# EAGLE design MBR (EAGLE 9.5.2)
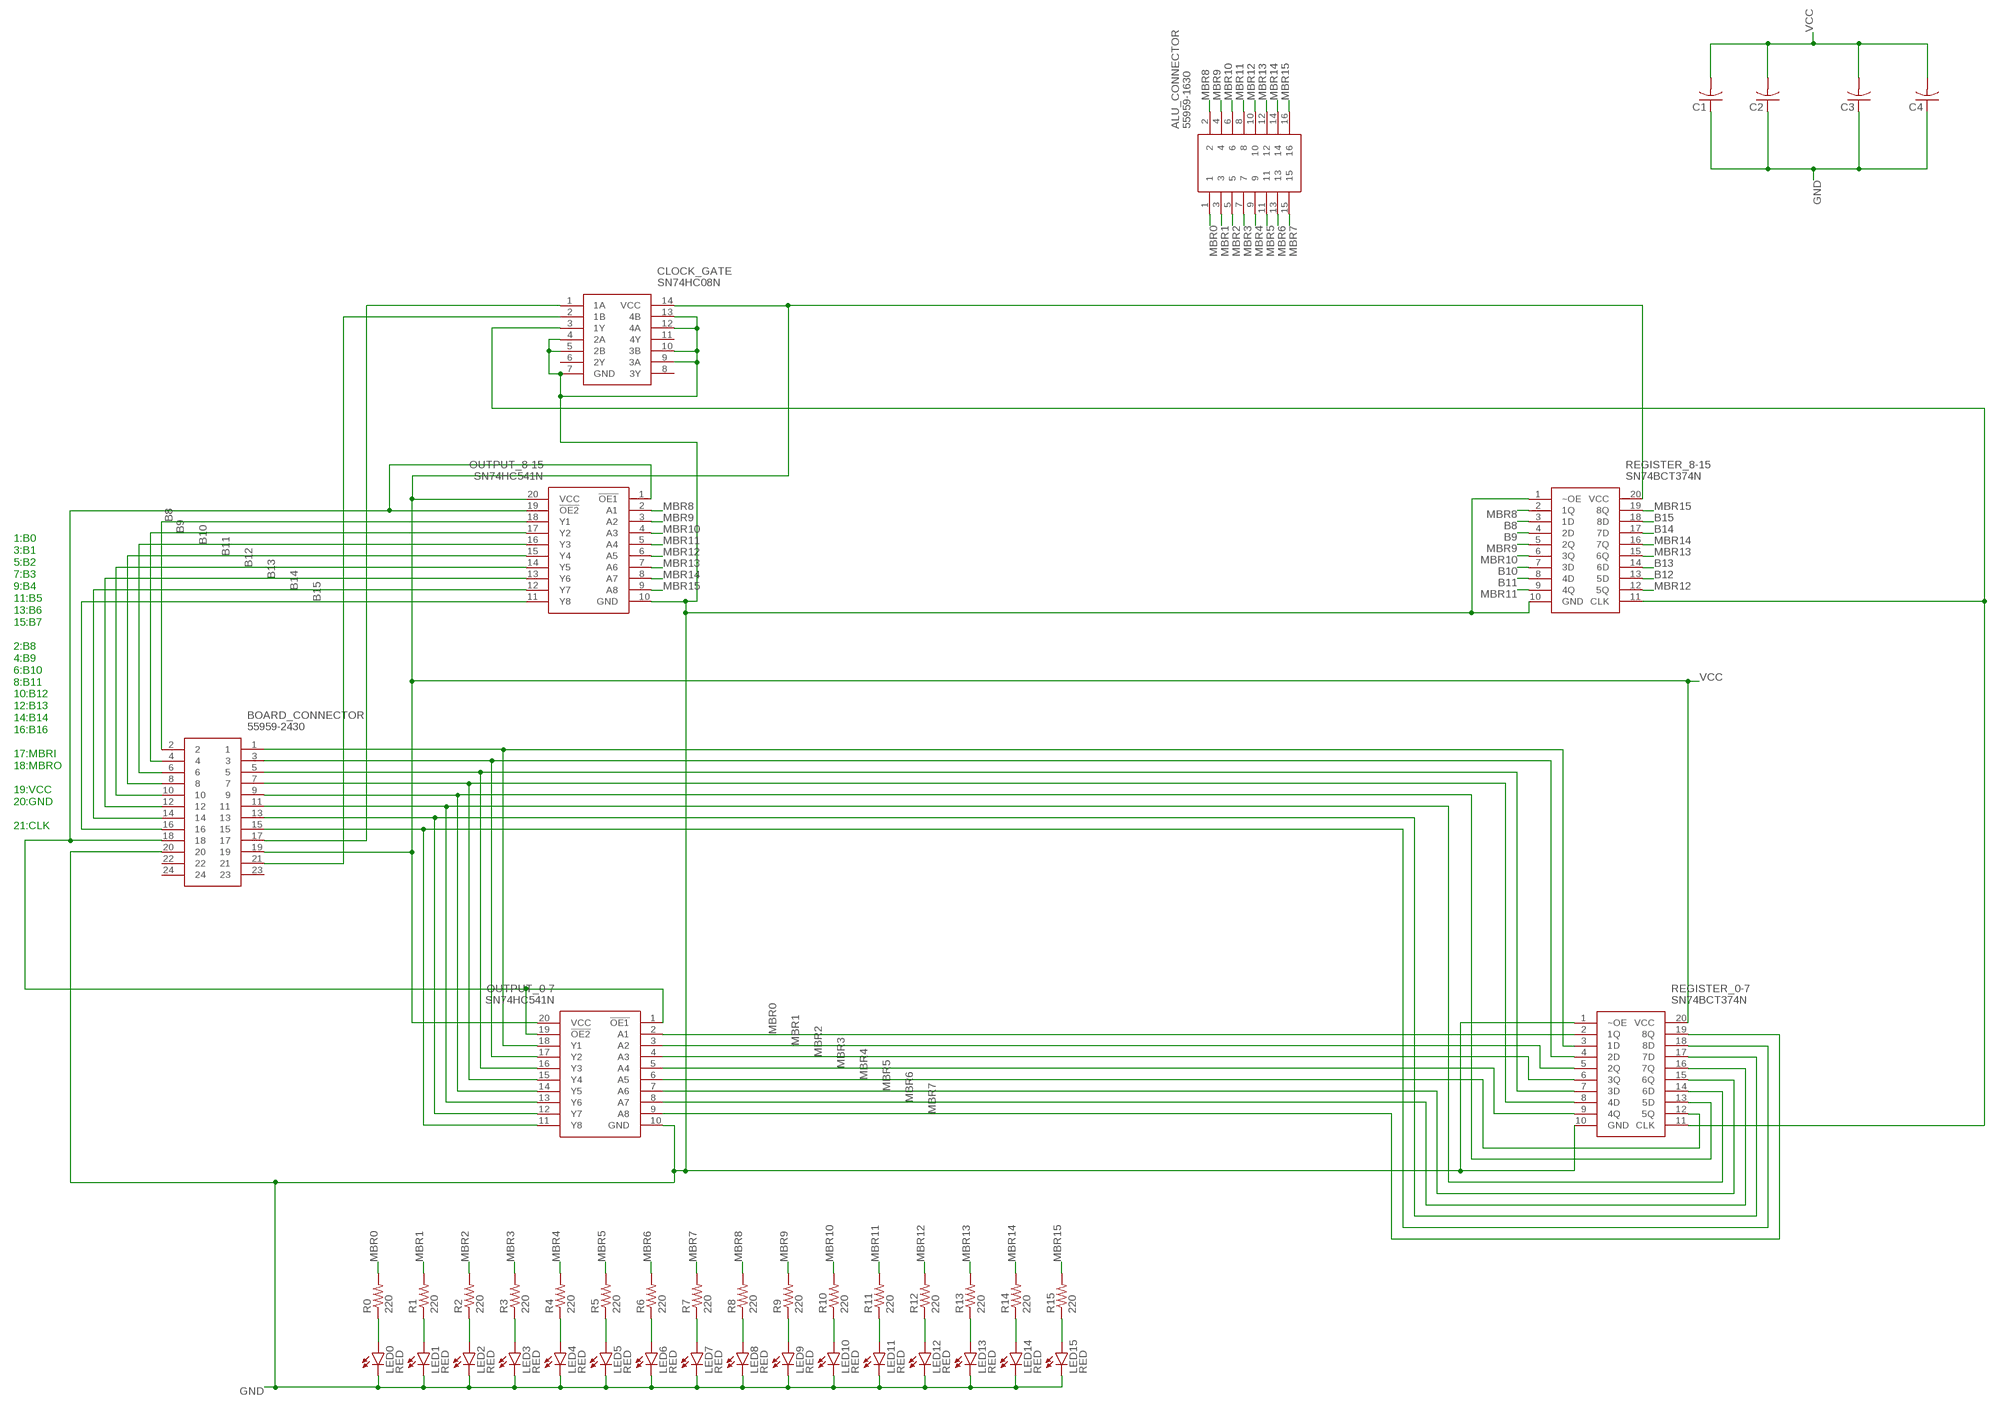
[diagram p0: schematic, sheet 1]

## Parts
ALU_CONNECTOR  55959-1630  [SHDR16W65P250X200_2X8_1940X140]
BOARD_CONNECTOR  55959-2430  [559592430]
C1  C-US025-024X044  [C025-024X044]
C2  C-US025-024X044  [C025-024X044]
C3  C-US025-024X044  [C025-024X044]
C4  C-US025-024X044  [C025-024X044]
CLOCK_GATE  SN74HC08N  [DIP794W53P254L1930H508Q14N]
LED0  RED  LED3MM  [LED3MM]
LED1  RED  LED3MM  [LED3MM]
LED2  RED  LED3MM  [LED3MM]
LED3  RED  LED3MM  [LED3MM]
LED4  RED  LED3MM  [LED3MM]
LED5  RED  LED3MM  [LED3MM]
LED6  RED  LED3MM  [LED3MM]
LED7  RED  LED3MM  [LED3MM]
LED8  RED  LED3MM  [LED3MM]
LED9  RED  LED3MM  [LED3MM]
LED10  RED  LED3MM  [LED3MM]
LED11  RED  LED3MM  [LED3MM]
LED12  RED  LED3MM  [LED3MM]
LED13  RED  LED3MM  [LED3MM]
LED14  RED  LED3MM  [LED3MM]
LED15  RED  LED3MM  [LED3MM]
OUTPUT_0-7  SN74HC541N  [DIP794W53P254L2540H508Q20N]
OUTPUT_8-15  SN74HC541N  [DIP794W53P254L2540H508Q20N]
R0  220  R-US_0204/7  [0204/7]
R1  220  R-US_0204/7  [0204/7]
R2  220  R-US_0204/7  [0204/7]
R3  220  R-US_0204/7  [0204/7]
R4  220  R-US_0204/7  [0204/7]
R5  220  R-US_0204/7  [0204/7]
R6  220  R-US_0204/7  [0204/7]
R7  220  R-US_0204/7  [0204/7]
R8  220  R-US_0204/7  [0204/7]
R9  220  R-US_0204/7  [0204/7]
R10  220  R-US_0204/7  [0204/7]
R11  220  R-US_0204/7  [0204/7]
R12  220  R-US_0204/7  [0204/7]
R13  220  R-US_0204/7  [0204/7]
R14  220  R-US_0204/7  [0204/7]
R15  220  R-US_0204/7  [0204/7]
REGISTER_0-7  SN74BCT374N  [DIP254P762X508-20]
REGISTER_8-15  SN74BCT374N  [DIP254P762X508-20]

## Nets
B8: BOARD_CONNECTOR.2 OUTPUT_8-15.18(Y1) REGISTER_8-15.3(1D)
B9: BOARD_CONNECTOR.4 OUTPUT_8-15.17(Y2) REGISTER_8-15.4(2D)
B10: BOARD_CONNECTOR.6 OUTPUT_8-15.16(Y3) REGISTER_8-15.7(3D)
B11: BOARD_CONNECTOR.8 OUTPUT_8-15.15(Y4) REGISTER_8-15.8(4D)
B12: BOARD_CONNECTOR.10 OUTPUT_8-15.14(Y5) REGISTER_8-15.13(5D)
B13: BOARD_CONNECTOR.12 OUTPUT_8-15.13(Y6) REGISTER_8-15.14(6D)
B14: BOARD_CONNECTOR.14 OUTPUT_8-15.12(Y7) REGISTER_8-15.17(7D)
B15: BOARD_CONNECTOR.16 OUTPUT_8-15.11(Y8) REGISTER_8-15.18(8D)
GND: BOARD_CONNECTOR.20 C1.1 C2.1 C3.1 C4.1 CLOCK_GATE.4(2A) CLOCK_GATE.5(2B) CLOCK_GATE.7(GND) CLOCK_GATE.9(3A) CLOCK_GATE.10(3B) CLOCK_GATE.12(4A) CLOCK_GATE.13(4B) LED0.K(C) LED1.K(C) LED2.K(C) LED3.K(C) LED4.K(C) LED5.K(C) LED6.K(C) LED7.K(C) LED8.K(C) LED9.K(C) LED10.K(C) LED11.K(C) LED12.K(C) LED13.K(C) LED14.K(C) LED15.K(C) OUTPUT_0-7.10(GND) OUTPUT_8-15.10(GND) REGISTER_0-7.1(~OE) REGISTER_0-7.10(GND) REGISTER_8-15.1(~OE) REGISTER_8-15.10(GND)
MBR0: ALU_CONNECTOR.1 OUTPUT_0-7.2(A1) R0.2 REGISTER_0-7.2(1Q)
MBR1: ALU_CONNECTOR.3 OUTPUT_0-7.3(A2) R1.2 REGISTER_0-7.5(2Q)
MBR2: ALU_CONNECTOR.5 OUTPUT_0-7.4(A3) R2.2 REGISTER_0-7.6(3Q)
MBR3: ALU_CONNECTOR.7 OUTPUT_0-7.5(A4) R3.2 REGISTER_0-7.9(4Q)
MBR4: ALU_CONNECTOR.9 OUTPUT_0-7.6(A5) R4.2 REGISTER_0-7.12(5Q)
MBR5: ALU_CONNECTOR.11 OUTPUT_0-7.7(A6) R5.2 REGISTER_0-7.15(6Q)
MBR6: ALU_CONNECTOR.13 OUTPUT_0-7.8(A7) R6.2 REGISTER_0-7.16(7Q)
MBR7: ALU_CONNECTOR.15 OUTPUT_0-7.9(A8) R7.2 REGISTER_0-7.19(8Q)
MBR8: ALU_CONNECTOR.2 OUTPUT_8-15.2(A1) R8.2 REGISTER_8-15.2(1Q)
MBR9: ALU_CONNECTOR.4 OUTPUT_8-15.3(A2) R9.2 REGISTER_8-15.5(2Q)
MBR10: ALU_CONNECTOR.6 OUTPUT_8-15.4(A3) R10.2 REGISTER_8-15.6(3Q)
MBR11: ALU_CONNECTOR.8 OUTPUT_8-15.5(A4) R11.2 REGISTER_8-15.9(4Q)
MBR12: ALU_CONNECTOR.10 OUTPUT_8-15.6(A5) R12.2 REGISTER_8-15.12(5Q)
MBR13: ALU_CONNECTOR.12 OUTPUT_8-15.7(A6) R13.2 REGISTER_8-15.15(6Q)
MBR14: ALU_CONNECTOR.14 OUTPUT_8-15.8(A7) R14.2 REGISTER_8-15.16(7Q)
MBR15: ALU_CONNECTOR.16 OUTPUT_8-15.9(A8) R15.2 REGISTER_8-15.19(8Q)
N$1: BOARD_CONNECTOR.15 OUTPUT_0-7.11(Y8) REGISTER_0-7.18(8D)
N$2: BOARD_CONNECTOR.13 OUTPUT_0-7.12(Y7) REGISTER_0-7.17(7D)
N$3: BOARD_CONNECTOR.11 OUTPUT_0-7.13(Y6) REGISTER_0-7.14(6D)
N$4: BOARD_CONNECTOR.9 OUTPUT_0-7.14(Y5) REGISTER_0-7.13(5D)
N$6: BOARD_CONNECTOR.7 OUTPUT_0-7.15(Y4) REGISTER_0-7.8(4D)
N$7: BOARD_CONNECTOR.5 OUTPUT_0-7.16(Y3) REGISTER_0-7.7(3D)
N$8: BOARD_CONNECTOR.3 OUTPUT_0-7.17(Y2) REGISTER_0-7.4(2D)
N$9: BOARD_CONNECTOR.1 OUTPUT_0-7.18(Y1) REGISTER_0-7.3(1D)
N$10: LED0.A R0.1
N$11: LED1.A R1.1
N$12: LED2.A R2.1
N$13: LED3.A R3.1
N$14: LED4.A R4.1
N$15: LED5.A R5.1
N$16: LED6.A R6.1
N$17: LED7.A R7.1
N$18: BOARD_CONNECTOR.18 OUTPUT_0-7.1(!OE1) OUTPUT_0-7.19(!OE2) OUTPUT_8-15.1(!OE1) OUTPUT_8-15.19(!OE2)
N$20: CLOCK_GATE.3(1Y) REGISTER_0-7.11(CLK) REGISTER_8-15.11(CLK)
N$21: LED8.A R8.1
N$22: BOARD_CONNECTOR.17 CLOCK_GATE.1(1A)
N$23: BOARD_CONNECTOR.21 CLOCK_GATE.2(1B)
N$24: LED9.A R9.1
N$25: LED10.A R10.1
N$26: LED11.A R11.1
N$27: LED12.A R12.1
N$28: LED13.A R13.1
N$29: LED14.A R14.1
N$30: LED15.A R15.1
VCC: BOARD_CONNECTOR.19 C1.2 C2.2 C3.2 C4.2 CLOCK_GATE.14(VCC) OUTPUT_0-7.20(VCC) OUTPUT_8-15.20(VCC) REGISTER_0-7.20(VCC) REGISTER_8-15.20(VCC)
Unconnected: BOARD_CONNECTOR.22 BOARD_CONNECTOR.23 BOARD_CONNECTOR.24 CLOCK_GATE.6(2Y) CLOCK_GATE.8(3Y) CLOCK_GATE.11(4Y)

## Notes on the sheet
- 1:B0
  3:B1
  5:B2
  7:B3
  9:B4
  11:B5
  13:B6
  15:B7
  
  2:B8
  4:B9
  6:B10
  8:B11
  10:B12
  12:B13
  14:B14
  16:B16
  
  17:MBRI
  18:MBRO
  
  19:VCC
  20:GND
  
  21:CLK

## Library data of the parts
ALU_CONNECTOR = SamacSys_Parts:55959-1630: Molex MICROCLASP Series, Series Number 55959, 2mm Pitch 16 Way 2 Row Right Angle PCB Header, Solder Termination, 3A Source: Datasheet <https://componentsearchengine.com/Datasheets/1/55959-1630.pdf>; DESCRIPTION: Molex MICROCLASP Series, Series Number 55959, 2mm Pitch 16 Way 2 Row Right Angle PCB Header, Solder Termination, 3A; HEIGHT: 11.7mm; MANUFACTURER_NAME: Molex; MANUFACTURER_PART_NUMBER: 55959-1630; MOUSER_PART_NUMBER: 538-55959-1630; MOUSER_PRICE-STOCK: https://www.mouser.com/Search/Refine.aspx?Keyword=538-55959-1630
BOARD_CONNECTOR = SamacSys_Parts:55959-2430: Headers & Wire Housings 24 Ckt R.A. Header Source: Datasheet <https://componentsearchengine.com/Datasheets/1/55959-2430.pdf>; DESCRIPTION: Headers & Wire Housings 24 Ckt R.A. Header; HEIGHT: 11.95mm; MANUFACTURER_NAME: Molex; MANUFACTURER_PART_NUMBER: 55959-2430; MOUSER_PART_NUMBER: 538-55959-2430; MOUSER_PRICE-STOCK: https://www.mouser.com/Search/Refine.aspx?Keyword=538-55959-2430
C1-C4 = rcl:C-US: CAPACITOR, American symbol; SPICEPREFIX: C
CLOCK_GATE = SamacSys_Parts:SN74HC08N: QUADRUPLE 2-INPUT POSITIVE-NOR GATES Source: Datasheet <http://componentsearchengine.com/Datasheets/1/SN74HC08N.pdf>; DESCRIPTION: QUADRUPLE 2-INPUT POSITIVE-NOR GATES; HEIGHT: 5.08mm; MANUFACTURER_NAME: Texas Instruments; MANUFACTURER_PART_NUMBER: SN74HC08N; MOUSER_PART_NUMBER: 595-SN74HC08N; MOUSER_PRICE-STOCK: https://www.mouser.com/Search/Refine.aspx?Keyword=595-SN74HC08N
LED0 LED1-LED15 = led:LED: LED OSRAM: - CHIPLED LG R971, LG N971, LY N971, LG Q971, LY Q971, LO R971, LY R971 LH N974, LH R974 LS Q976, LO Q976, LY Q976 LO Q996 - Hyper CHIPLED LW Q18S LB Q993, LB Q99A, LB R99A - SideLED LS A670, LO A670, LY A670, LG A670, LP A670 LB A673, LV A673, LT A673, LW A673 LH A674 LY A675 LS A676, LA A676, LO A676, LY A676, LW A676 LS A679, LY A679, LG A679 - Hyper Micro SIDELED® LS Y876, LA Y876, LO Y876, LY Y876 LT Y87S - SmartLED LW L88C, LW L88S LB L89C, LB L89S, LG L890 LS L89K, LO L89K, LY L89K LS L896, LA L896, LO L896, LY L896 - TOPLED LS T670, LO T670, LY T670, LG T670, LP T670 LSG T670, LSP T670, LSY T670, LOP T670, LYG T670 LG T671, LOG T671, LSG T671 LB T673, LV T673, LT T673, LW T673 LH T674 LS T676, LA T676, LO T676, LY T676, LB T676, LH T676, LSB T676, LW T676 LB T67C, LV T67C, LT T67C, LS T67K, LO T67K, LY T67K, LW E67C LS E67B, LA E67B, LO E67B, LY E67B, LB E67C, LV E67C, LT E67C LW T67C LS T679, LY T679, LG T679 LS T770, LO T770, LY T770, LG T770, LP T770 LB T773, LV T773, LT T773, LW T773 LH T774 LS E675, LA E675, LY E675, LS T675 LS T776, LA T776, LO T776, LY T776, LB T776 LHGB T686 LT T68C, LB T68C - Hyper Mini TOPLED® LB M676 - Mini TOPLED Santana® LG M470 LS M47K, LO M47K, LY M47K Source: http://www.osram.convergy.de LUXEON: - LUMILED® LXK2-PW12-R00, LXK2-PW12-S00, LXK2-PW14-U00, LXK2-PW14-V00 LXK2-PM12-R00, LXK2-PM12-S00, LXK2-PM14-U00 LXK2-PE12-Q00, LXK2-PE12-R00, LXK2-PE12-S00, LXK2-PE14-T00, LXK2-PE14-U00 LXK2-PB12-K00, LXK2-PB12-L00, LXK2-PB12-M00, LXK2-PB14-N00, LXK2-PB14-P00, LXK2-PB14-Q00 LXK2-PR12-L00, LXK2-PR12-M00, LXK2-PR14-Q00, LXK2-PR14-R00 LXK2-PD12-Q00, LXK2-PD12-R00, LXK2-PD12-S00 LXK2-PH12-R00, LXK2-PH12-S00 LXK2-PL12-P00, LXK2-PL12-Q00, LXK2-PL12-R00 Source: www.luxeon.com KINGBRIGHT: KA-3528ASYC Source: www.kingbright.com
OUTPUT_0-7 OUTPUT_8-15 = SamacSys_Parts:SN74HC541N: Octal Buffers And Line Drivers With 3-State Outputs Source: Datasheet <http://componentsearchengine.com/Datasheets/3/SN74HC541N.pdf>; DESCRIPTION: Octal Buffers And Line Drivers With 3-State Outputs; HEIGHT: 5.08mm; MANUFACTURER_NAME: Texas Instruments; MANUFACTURER_PART_NUMBER: SN74HC541N; MOUSER_PART_NUMBER: 595-SN74HC541N; MOUSER_PRICE-STOCK: https://www.mouser.com/Search/Refine.aspx?Keyword=595-SN74HC541N
R0 R1-R15 = rcl:R-US_: RESISTOR, American symbol; SPICEPREFIX: R
REGISTER_0-7 REGISTER_8-15 = SamacSys_Parts:SN74BCT374N: OCTAL EDGE TRIGGERED D TYPE LATCHES Source: Datasheet; DESCRIPTION: OCTAL EDGE TRIGGERED D TYPE LATCHES; HEIGHT: mm; MANUFACTURER_NAME: Texas Instruments; MANUFACTURER_PART_NUMBER: SN74BCT374N; MOUSER_PART_NUMBER: 595-SN74BCT374N; MOUSER_PRICE-STOCK: https://www.mouser.com/Search/Refine.aspx?Keyword=595-SN74BCT374N

## Board
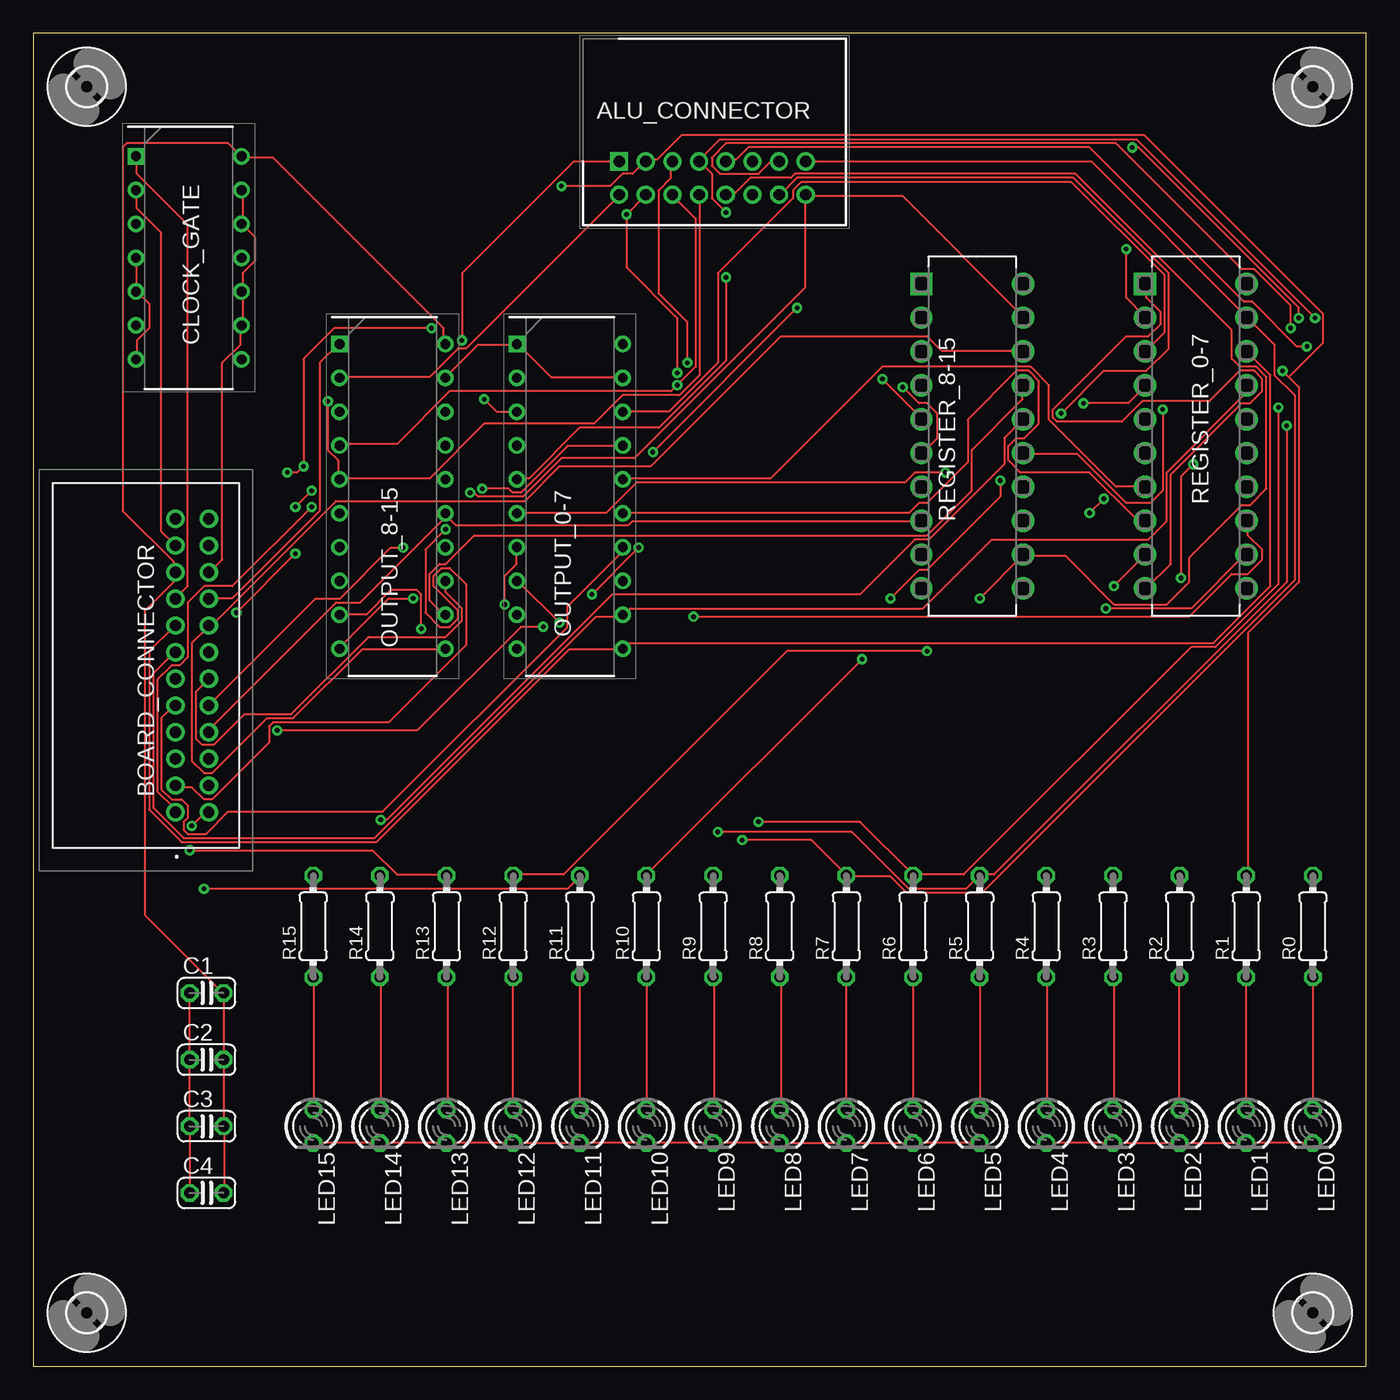
[diagram p1: board, top side]
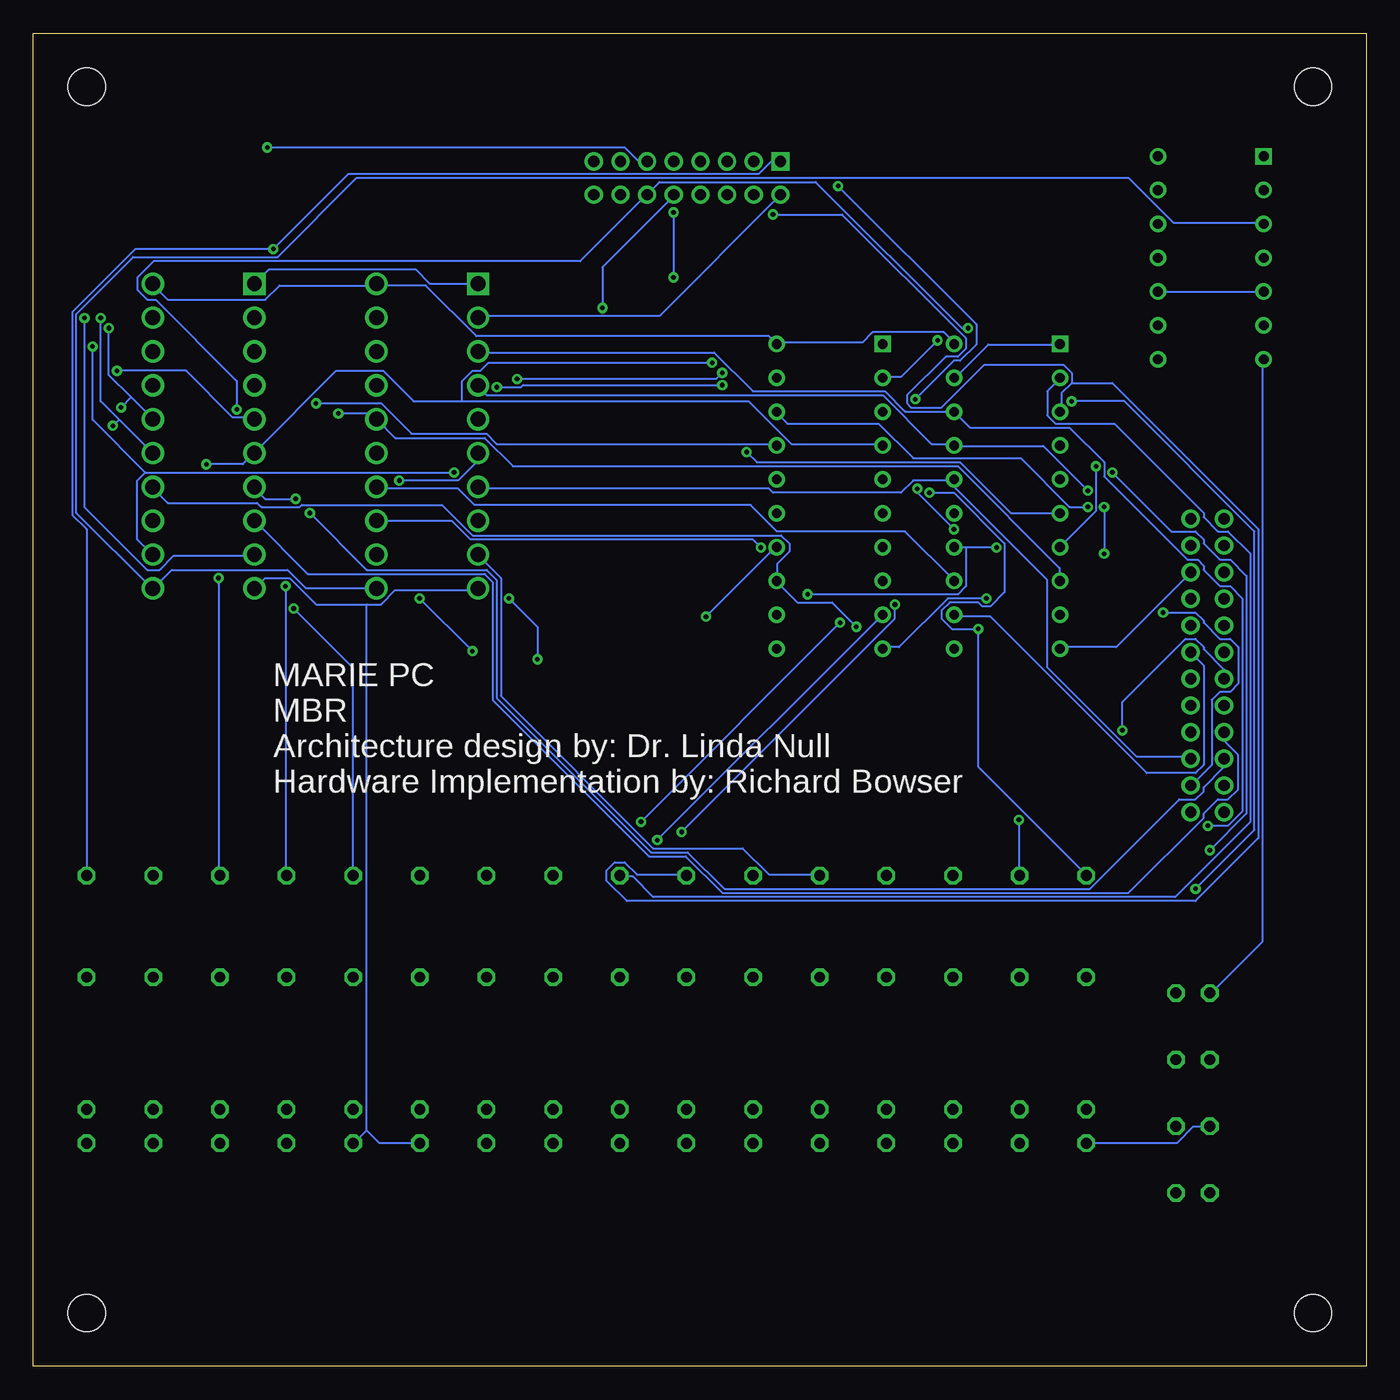
[diagram p2: board, bottom side, seen from below]

Size 100 x 100 mm. Coordinates in mm from the lower left corner, seen from the top.
Outline: 0,0 100,0 100,100 0,100 0,0
Copper layers (1*16): Top 0.035mm / dielectric 1.5mm / Bottom 0.035mm
Design rules "default": minimum track width 6mil, minimum drill 0.35mm, track to track 6mil, track to pad 6mil, pad to pad 6mil, via to via 6mil, smd to smd 6mil, copper to edge 40mil, drill to drill 6mil, minimum pad ring 10mil, minimum via ring 8mil, stop-mask expansion 4mil, vias tented up to drill 0mil, thermal gap 10mil

### Footprints (pad centres in the part's own frame; a part is rotated, then mirrored left to right if it is on the bottom)
SHDR16W65P250X200_2X8_1940X140 = drill 0.85 pad 1.275 square: 1 0,0 | drill 0.85 pad 1.275: 2 0,2.5; 3 -2,0; 4 -2,2.5; 5 -4,0; 6 -4,2.5; 7 -6,0; 8 -6,2.5; 9 -8,0; 10 -8,2.5; 11 -10,0; 12 -10,2.5; 13 -12,0; 14 -12,2.5; 15 -14,0; 16 -14,2.5
559592430 = drill 0.85 pad 1.381: 1 0,0; 2 0,-2.5; 3 2,0; 4 2,-2.5; 5 4,0; 6 4,-2.5; 7 6,0; 8 6,-2.5; 9 8,0; 10 8,-2.5; 11 10,0; 12 10,-2.5; 13 12,0; 14 12,-2.5; 15 14,0; 16 14,-2.5; 17 16,0; 18 16,-2.5; 19 18,0; 20 18,-2.5; 21 20,0; 22 20,-2.5; 23 22,0; 24 22,-2.5
C025-024X044 = drill 0.813 octagon: 1 -1.27,0; 2 1.27,0
DIP794W53P254L1930H508Q14N = drill 0.73 pad 1.13 square: 1 -3.97,7.62 | drill 0.73 pad 1.13: 2 -3.97,5.08; 3 -3.97,2.54; 4 -3.97,0; 5 -3.97,-2.54; 6 -3.97,-5.08; 7 -3.97,-7.62; 8 3.97,-7.62; 9 3.97,-5.08; 10 3.97,-2.54; 11 3.97,0; 12 3.97,2.54; 13 3.97,5.08; 14 3.97,7.62
LED3MM = drill 0.813 octagon: A -1.27,0; K 1.27,0
DIP794W53P254L2540H508Q20N = drill 0.73 pad 1.13 square: 1 -3.97,11.43 | drill 0.73 pad 1.13: 2 -3.97,8.89; 3 -3.97,6.35; 4 -3.97,3.81; 5 -3.97,1.27; 6 -3.97,-1.27; 7 -3.97,-3.81; 8 -3.97,-6.35; 9 -3.97,-8.89; 10 -3.97,-11.43; 11 3.97,-11.43; 12 3.97,-8.89; 13 3.97,-6.35; 14 3.97,-3.81; 15 3.97,-1.27; 16 3.97,1.27; 17 3.97,3.81; 18 3.97,6.35; 19 3.97,8.89; 20 3.97,11.43
0204/7 = drill 0.813 octagon: 1 -3.81,0; 2 3.81,0
DIP254P762X508-20 = drill 1.118 pad 1.676 square: 1 -7.62,22.86 | drill 1.118 pad 1.676: 2 -7.62,20.32; 3 -7.62,17.78; 4 -7.62,15.24; 5 -7.62,12.7; 6 -7.62,10.16; 7 -7.62,7.62; 8 -7.62,5.08; 9 -7.62,2.54; 10 -7.62,0; 11 0,0; 12 0,2.54; 13 0,5.08; 14 0,7.62; 15 0,10.16; 16 0,12.7; 17 0,15.24; 18 0,17.78; 19 0,20.32; 20 0,22.86
2,8 = hole 2.8: 0,0

### Placement (x,y rotation side)
ALU_CONNECTOR  43.95,90.39 180 top
BOARD_CONNECTOR  10.66,41.57 90 top
C1  13,28 0 top
C2  13,23 0 top
C3  13,18 0 top
C4  13,13 0 top
CLOCK_GATE  11.66,83.16 0 top
LED0  96,18 270 top
LED1  91,18 270 top
LED2  86,18 270 top
LED3  81,18 270 top
LED4  76,18 270 top
LED5  71,18 270 top
LED6  66,18 270 top
LED7  61,18 270 top
LED8  56,18 270 top
LED9  51,18 270 top
LED10  46,18 270 top
LED11  41,18 270 top
LED12  36,18 270 top
LED13  31,18 270 top
LED14  26,18 270 top
LED15  21,18 270 top
OUTPUT_0-7  40.25,65.26 0 top
OUTPUT_8-15  26.95,65.26 0 top
R0  96,33 90 top
R1  91,33 90 top
R2  86,33 90 top
R3  81,33 90 top
R4  76,33 90 top
R5  71,33 90 top
R6  66,33 90 top
R7  61,33 90 top
R8  56,33 90 top
R9  51,33 90 top
R10  46,33 90 top
R11  41,33 90 top
R12  36,33 90 top
R13  31,33 90 top
R14  26,33 90 top
R15  21,33 90 top
REGISTER_0-7  91.03,58.35 0 top
REGISTER_8-15  74.25,58.35 0 top
U$1  [2,8]  4,4 0 top
U$2  [2,8]  96,4 0 top
U$3  [2,8]  96,96 0 top
U$4  [2,8]  4,96 0 top

### Tracks (layer width: path | path; a pad name or v marks a point on that pad's centre or on a via)
B8  (via drill 0.35)
  Top 0.152: v11.89,40.54 12.8,41.45 13.11,41.45 BOARD_CONNECTOR.2
  Bottom 0.152: REGISTER_8-15.3 66.6,76.05 48.92,76.05 46.02,73.15 36.12,73.15 34.59,71.63 30.94,71.63 OUTPUT_8-15.18 30.79,71.48 29.72,70.41 22.25,70.41 19.66,67.82 19.66,66.75 13.41,60.5 12.65,60.5 12.19,60.05 12.19,59.74 10.97,58.52 10.21,58.52 9.3,57.61 9.3,41.6 10.36,40.54 v11.89,40.54
B9  (via drill 0.35)
  Top 0.152: v19.66,60.96 v15.24,56.54 | v20.88,65.68 v19.66,64.47
  Bottom 0.152: REGISTER_8-15.4 66.6,73.46 65.99,72.85 36.27,72.85 32.61,69.19 30.94,69.19 OUTPUT_8-15.17 30.79,69.04 24.23,69.04 v20.88,65.68 | v15.24,56.54 12.8,56.54 12.19,55.93 12.19,55.78 10.97,54.56 10.21,54.56 9.6,53.95 9.6,51.21 10.21,50.6 10.97,50.6 11.58,49.99 11.58,45.11 13.11,43.59 BOARD_CONNECTOR.4 | v19.66,64.47 v19.66,60.96
B10
  Bottom 0.152: BOARD_CONNECTOR.6 13.26,45.72 17.22,45.72 23.93,52.43 23.93,58.98 30.79,65.84 30.79,66.45 OUTPUT_8-15.16 30.94,66.45 33.98,66.45 34.9,65.53 44.5,65.53 44.81,65.84 66.6,65.84 REGISTER_8-15.7
B11
  Top 0.152: BOARD_CONNECTOR.8 13.11,47.7 22.71,57.3 24.54,57.3 30.79,63.55 30.79,63.86 OUTPUT_8-15.15 30.94,63.86 31.7,63.09 44.65,63.09 44.96,63.4 66.6,63.4 REGISTER_8-15.8
B12  (via drill 0.35)
  Top 0.152: v27.74,61.42 26.82,61.42 23.01,57.61 21.18,57.61 13.26,49.68 BOARD_CONNECTOR.10 | v41.91,57.91 v45.41,61.42
  Bottom 0.152: v27.74,61.42 30.02,61.42 | 30.02,61.42 30.79,61.42 OUTPUT_8-15.14 | v45.41,61.42 46.02,62.03 67.21,62.03 68.58,63.4 74.22,63.4 REGISTER_8-15.13 | v41.91,57.91 30.63,57.91 30.02,58.52 30.02,61.42
B13
  Top 0.152: OUTPUT_8-15.13 30.94,58.83 30.94,58.06 32.16,56.84 32.16,55.93 30.94,54.71 25.15,54.71 19.36,48.92 15.85,48.92 13.56,46.63 12.65,46.63 12.19,47.09 12.19,50.6 13.11,51.51 BOARD_CONNECTOR.12
  Bottom 0.152: REGISTER_8-15.14 74.22,65.84 68.12,65.84 66.9,64.62 46.18,64.62 44.2,62.64 34.59,62.64 30.94,58.98 OUTPUT_8-15.13
B14
  Top 0.152: REGISTER_8-15.17 74.22,73.46 74.22,72.54 70.41,68.73 70.41,65.68 67.06,62.33 33.07,62.33 30.94,60.2 30.48,60.2 29.72,59.44 29.72,57.45 30.79,56.39 OUTPUT_8-15.12
  Bottom 0.152: OUTPUT_8-15.12 30.79,56.24 28.19,56.24 16.46,44.5 12.8,44.5 12.19,45.11 12.19,52.58 13.11,53.49 BOARD_CONNECTOR.14
B15
  Top 0.152: OUTPUT_8-15.11 30.79,53.8 24.69,53.8 19.51,48.62 17.53,48.62 13.41,44.5 12.8,44.5 11.89,45.41 11.89,54.25 13.11,55.47 BOARD_CONNECTOR.16 13.26,55.47 22.71,64.92 36.88,64.92 39.47,67.51 46.33,67.51 56.08,77.27 67.06,77.27 68.12,76.2 74.22,76.2 REGISTER_8-15.18
GND  (via drill 0.35)
  Top 0.152: CLOCK_GATE.7 7.77,75.59 7.77,76.96 8.69,77.88 8.69,79.7 7.77,80.62 CLOCK_GATE.5 7.77,80.77 7.77,83.06 CLOCK_GATE.4 | CLOCK_GATE.13 15.7,88.24 15.7,85.8 CLOCK_GATE.12 15.7,85.65 16.61,84.73 16.61,82.91 15.7,81.99 15.7,80.77 CLOCK_GATE.10 15.7,80.62 15.7,78.18 CLOCK_GATE.9 15.54,78.03 15.54,76.66 14.17,75.29 14.17,60.5 13.26,59.59 BOARD_CONNECTOR.20 | v28.5,57.61 26.67,57.61 23.01,53.95 OUTPUT_8-15.10 | C4.1 11.73,13.11 11.73,17.98 C3.1 11.73,18.14 11.73,22.86 C2.1 11.73,23.01 11.73,27.89 C1.1 | LED15.K 21.03,16.76 25.91,16.76 LED14.K 26.06,16.76 30.94,16.76 LED13.K 31.09,16.76 35.97,16.76 LED12.K 36.12,16.76 41,16.76 LED11.K 41.15,16.76 45.87,16.76 LED10.K 46.02,16.76 50.9,16.76 LED9.K 51.05,16.76 55.93,16.76 LED8.K 56.08,16.76 60.96,16.76 LED7.K 61.11,16.76 65.99,16.76 LED6.K 66.14,16.76 70.87,16.76 LED5.K | LED0.K 95.86,16.76 91.14,16.76 LED1.K 90.98,16.76 86.11,16.76 LED2.K 85.95,16.76 81.08,16.76 LED3.K 80.92,16.76 76.05,16.76 LED4.K | REGISTER_0-7.1 83.52,81.08 83.52,80.16 84.58,79.1 84.58,78.18 83.67,77.27 81.99,77.27 76.5,71.78 76.5,71.17 76.81,70.87 81.69,70.87 83.21,72.39 88.24,72.39 90.53,74.68 91.59,74.68 92.2,74.07 92.2,73.15 91.29,72.24 90.68,72.24 85.34,66.9 85.34,60.2 83.52,58.37 REGISTER_0-7.10
  Bottom 0.152: CLOCK_GATE.5 7.77,80.62 15.54,80.62 CLOCK_GATE.10 | OUTPUT_8-15.10 22.86,53.95 18.75,53.95 13.26,59.44 BOARD_CONNECTOR.20 | v28.5,57.61 31.39,57.61 35.05,53.95 36.27,53.95 OUTPUT_0-7.10 | C3.1 11.73,17.98 12.95,17.98 14.17,16.76 20.88,16.76 LED15.K | REGISTER_8-15.1 66.75,81.23 70.26,81.23 71.32,82.3 82.3,82.3 83.36,81.23 REGISTER_0-7.1 | 74.98,57.15 78.79,57.15 80.77,59.13 82.6,59.13 83.36,58.37 REGISTER_0-7.10 | 74.98,57.15 73.91,57.15 72.85,58.22 66.75,58.22 REGISTER_8-15.10 | 74.98,17.68 74.98,57.15 | 74.98,17.68 75.89,16.76 LED4.K | 74.98,17.68 74.07,16.76 71.02,16.76 LED5.K | CLOCK_GATE.7 7.77,75.44 7.77,31.85 11.58,28.04 C1.1
MBR0  (via drill 0.35)
  Top 0.152: v32.16,76.96 32.16,81.99 40.54,90.37 43.89,90.37 ALU_CONNECTOR.1 | v81.99,83.82 81.99,80.16 83.36,78.79 REGISTER_0-7.2
  Bottom 0.152: v32.16,76.96 34.9,74.22 36.27,74.22 OUTPUT_0-7.2 | R0.2 96.01,36.88 96.01,62.79 97.08,63.86 97.08,79.1 92.35,83.82 v81.99,83.82 76.35,89.46 45.57,89.46 44.65,90.37 44.04,90.37 ALU_CONNECTOR.1
MBR1  (via drill 0.35)
  Top 0.152: v33.83,72.54 34.75,71.63 36.27,71.63 OUTPUT_0-7.3 | v39.62,88.54 43.28,88.54 44.2,89.46 44.96,89.46 45.87,90.37 ALU_CONNECTOR.3 46.02,90.53 46.79,90.53 48.62,92.35 83.36,92.35 96.77,78.94 96.77,76.81 94.18,74.22 | v93.73,74.68 94.18,74.22 | 94.18,74.22 94.94,73.46 94.94,58.83 91.14,55.02 91.14,36.88 R1.2
  Bottom 0.152: v33.83,72.54 30.94,75.44 30.48,75.44 29.26,76.66 29.26,78.18 v39.62,88.54 | v93.73,74.68 88.54,74.68 85.04,71.17 83.52,71.17 REGISTER_0-7.5
MBR2  (via drill 0.35)
  Top 0.152: v86.11,59.13 86.11,66.75 v87.02,67.67 | v49.07,75.29 49.07,78.33 46.94,80.47 46.94,88.24 47.85,89.15 47.85,90.37 ALU_CONNECTOR.5
  Bottom 0.152: 67.82,72.39 71.48,72.39 73.76,74.68 77.27,74.68 83.36,68.58 REGISTER_0-7.6 83.52,68.43 84.28,67.67 v87.02,67.67 | 67.82,72.39 46.33,72.39 43.13,69.19 36.42,69.19 OUTPUT_0-7.4 | v86.11,59.13 86.11,36.88 R2.2 | v49.07,75.29 65.84,75.29 66.45,74.68 67.06,74.68 67.82,73.91 67.82,72.39
MBR3  (via drill 0.35)
  Top 0.152: v81.08,58.52 83.36,60.81 REGISTER_0-7.9 | v51.97,81.69 51.97,75.44 46.94,70.41 41,70.41 37.19,66.6 36.42,66.6 OUTPUT_0-7.5 | v51.97,86.56 50.9,87.63 50.9,89.46 49.99,90.37 ALU_CONNECTOR.7 49.99,90.53 51.51,92.05 82.75,92.05 v96.16,78.64
  Bottom 0.152: v81.08,58.52 81.08,36.88 R3.2 | v51.97,86.56 v51.97,81.69 | v96.16,78.64 96.16,64.47 91.44,59.74 90.53,59.74 89.46,60.81 83.52,60.81 REGISTER_0-7.9
MBR4  (via drill 0.35)
  Top 0.152: v68.43,67.06 66.14,67.06 65.38,66.29 45.26,66.29 42.98,64.01 36.42,64.01 OUTPUT_0-7.6 | v80.47,56.84 86.87,56.84 90.98,60.96 REGISTER_0-7.12 | v95.56,76.5 94.79,76.5 91.44,79.86 90.83,79.86 79.25,91.44 53.65,91.44 52.73,90.53 51.97,90.53 ALU_CONNECTOR.9
  Bottom 0.152: 91.59,67.06 v68.43,67.06 | 91.59,67.06 92.2,66.45 92.2,62.03 91.14,60.96 REGISTER_0-7.12 | v80.47,56.84 76.05,52.43 76.05,36.88 R4.2 | v95.56,76.5 95.56,71.02 91.59,67.06
MBR5  (via drill 0.35)
  Top 0.152: v35.36,57.15 35.36,59.28 36.27,60.2 36.27,61.42 OUTPUT_0-7.7 | v51.36,40.08 61.42,40.08 65.68,35.81 69.95,35.81 70.87,36.73 R5.2 71.02,36.88 72.08,36.88 94.03,58.83 v94.03,70.56 | v82.45,91.44 82.91,91.44 94.94,79.4 v94.94,78.64
  Bottom 0.152: v35.36,57.15 35.36,56.08 v51.36,40.08 | v82.45,91.44 55.63,91.44 54.71,90.53 54.1,90.53 ALU_CONNECTOR.11 | v94.94,78.64 94.94,72.39 93.57,71.02 | 93.57,71.02 91.14,68.58 REGISTER_0-7.15 | 93.57,71.02 v94.03,70.56
MBR6  (via drill 0.35)
  Top 0.152: v39.47,55.78 36.42,58.83 OUTPUT_0-7.8 | v54.41,40.84 62.03,40.84 65.99,36.88 R6.2 66.14,36.88 69.8,36.88 86.87,53.95 88.7,53.95 93.42,58.67 v93.42,71.93 | v94.34,77.88 94.34,79.55 91.59,82.3 90.68,82.3 81.23,91.75 51.97,91.75 50.9,90.68 50.9,90.07 51.51,89.46 54.41,89.46 55.32,90.37 55.93,90.37 ALU_CONNECTOR.13
  Bottom 0.152: v54.41,40.84 v39.47,55.78 | v94.34,77.88 94.34,74.37 92.66,72.69 | 92.66,72.69 91.14,71.17 REGISTER_0-7.16 | 92.66,72.69 v93.42,71.93
MBR7  (via drill 0.35)
  Top 0.152: v53.19,39.47 58.37,39.47 60.96,36.88 R7.2 61.11,36.73 64.31,36.73 65.53,35.51 71.17,35.51 94.64,58.98 94.64,72.85 93.12,74.37 93.12,76.66 91.14,78.64 REGISTER_0-7.19 90.98,78.79 79.4,90.37 58.06,90.37 ALU_CONNECTOR.15
  Bottom 0.152: v53.19,39.47 36.42,56.24 OUTPUT_0-7.9
MBR8
  Top 0.152: OUTPUT_8-15.2 23.01,74.22 29.72,74.22 31.85,76.35 32.46,76.35 43.89,87.78 ALU_CONNECTOR.2
  Bottom 0.152: R8.2 55.93,36.73 55.02,36.73 53.49,35.2 14.33,35.2 8.69,40.84 8.69,60.96 10.36,62.64 11.12,62.64 12.19,63.7 12.19,64.01 18.9,70.71 23.32,70.71 23.93,71.32 23.93,73.15 23.01,74.07 OUTPUT_8-15.2 | REGISTER_8-15.2 66.6,78.79 53.03,78.79 44.04,87.78 ALU_CONNECTOR.2
MBR9  (via drill 0.35)
  Top 0.152: ALU_CONNECTOR.4 45.87,87.78 v44.5,86.41 44.5,82.45 48.31,78.64 v48.31,74.52 | v63.7,74.07 66.6,71.17 REGISTER_8-15.5
  Bottom 0.152: 22.1,73.76 22.86,73 22.86,71.63 OUTPUT_8-15.3 | 22.1,73.76 22.1,74.52 22.71,75.13 28.65,75.13 31.85,71.93 34.14,71.93 34.44,72.24 34.44,72.85 31.55,75.74 30.63,75.74 30.02,76.35 30.02,77.11 39.32,86.41 v44.5,86.41 | 22.1,73.76 19.05,73.76 8.08,62.79 8.08,39.62 12.8,34.9 55.47,34.9 57,36.42 57,37.19 56.39,37.8 55.63,37.8 54.71,36.88 51.05,36.88 R9.2 | v63.7,74.07 48.77,74.07 v48.31,74.52
MBR10  (via drill 0.35)
  Top 0.152: OUTPUT_8-15.4 23.01,69.19 27.28,69.19 31.24,73.15 47.85,73.15 v48.31,73.61 49.68,74.98 49.68,86.11 48.01,87.78 ALU_CONNECTOR.6 | v62.18,53.03 46.02,36.88 R10.2 | v64.31,57.61 66.45,59.74 67.06,59.74 72.54,65.23 v72.54,66.45 | v65.23,73.46 66.45,72.24 67.06,72.24 67.82,71.48 67.82,69.65 66.75,68.58 REGISTER_8-15.6
  Bottom 0.152: v62.18,53.03 62.18,55.47 v64.31,57.61 | v72.54,66.45 68.12,66.45 66.75,67.82 66.75,68.43 REGISTER_8-15.6 | v48.31,73.61 63.25,73.61 63.4,73.46 v65.23,73.46
MBR11  (via drill 0.35)
  Top 0.152: ALU_CONNECTOR.8 49.99,87.78 49.99,74.37 48.46,72.85 44.2,72.85 42.06,70.71 33.83,70.71 29.72,66.6 23.01,66.6 OUTPUT_8-15.5 22.86,66.6 22.86,67.97 22.1,68.73 v22.1,72.39 | v12.8,35.81 40.08,35.81 41,36.73 R11.2
  Bottom 0.152: R11.2 41.15,36.88 44.81,36.88 46.79,38.86 53.49,38.86 64.92,50.29 64.92,59.13 66.6,60.81 REGISTER_8-15.9 | v22.1,72.39 18.14,72.39 8.38,62.64 8.38,40.23 v12.8,35.81
MBR12  (via drill 0.35)
  Top 0.152: v57.3,79.4 v46.48,68.58 | v67.06,53.65 56.54,53.65 39.78,36.88 36.12,36.88 R12.2 | v71.02,57.61 74.22,60.81 REGISTER_8-15.12 74.37,60.81 77.42,60.81 81.08,57.15 85.04,57.15 86.72,58.83 86.72,60.66 90.68,64.62 91.29,64.62 92.51,65.84 92.51,74.22 91.75,74.98 90.53,74.98 89.92,75.59 89.92,77.72 78.18,89.46 57.15,89.46 56.84,89.15 53.8,89.15 52.58,87.94 51.97,87.94 ALU_CONNECTOR.10
  Bottom 0.152: v46.48,68.58 45.72,67.82 30.48,67.82 26.67,64.01 23.01,64.01 OUTPUT_8-15.6 | v57.3,79.4 57.3,82.45 51.97,87.78 ALU_CONNECTOR.10 | v71.02,57.61 v67.06,53.65
MBR13  (via drill 0.35)
  Top 0.152: v29.87,77.88 22.55,77.88 20.27,75.59 v20.27,67.51 19.81,67.06 v19.05,67.06 | v11.73,38.71 25.45,38.71 27.28,36.88 30.94,36.88 R13.2 | v84.73,71.78 84.73,65.68 83.82,64.77 81.99,64.77 78.33,68.43 74.37,68.43 REGISTER_8-15.15
  Bottom 0.152: v20.27,67.51 20.27,64.16 22.86,61.57 OUTPUT_8-15.7 | v29.87,77.88 30.33,77.88 41.3,88.85 53.03,88.85 53.95,87.94 ALU_CONNECTOR.12 54.1,87.78 58.98,82.91 90.98,82.91 92.2,81.69 92.2,80.77 91.44,80.01 90.83,80.01 84.73,73.91 v84.73,71.78 | v11.73,38.71 8.99,41.45 8.99,59.28 10.21,60.5 10.97,60.5 12.19,61.72 12.19,62.03 12.8,62.64 14.63,62.64 v19.05,67.06
MBR14  (via drill 0.35)
  Top 0.152: v26.06,41 26.52,41 43.43,57.91 62.03,57.91 66.14,62.03 67.21,62.03 72.85,67.67 72.85,69.65 74.22,71.02 REGISTER_8-15.16 | v77.11,71.48 80.31,74.68 83.52,74.68 85.19,76.35 85.19,81.99 78.03,89.15 57.3,89.15 56.08,87.94 ALU_CONNECTOR.14
  Bottom 0.152: OUTPUT_8-15.8 23.01,58.98 23.01,59.89 30.63,67.51 64.01,67.51 66.14,69.65 72.85,69.65 74.22,71.02 REGISTER_8-15.16 74.37,71.17 74.68,71.48 v77.11,71.48 | v26.06,41 26.06,36.88 R14.2
MBR15  (via drill 0.35)
  Top 0.152: v29.11,55.32 29.11,57.91 28.8,58.22 26.82,58.22 24.99,56.39 23.01,56.39 OUTPUT_8-15.9 | REGISTER_8-15.19 74.22,78.79 65.23,87.78 58.06,87.78 ALU_CONNECTOR.16 57.91,87.78 57.91,80.92 45.11,68.12 39.62,68.12 36.73,65.23 33.38,65.23 33.07,65.53 v32.77,65.53
  Bottom 0.152: R15.2 21.03,36.88 29.11,44.96 v29.11,55.32 31.09,55.32 31.85,56.08 31.85,56.69 31.24,57.3 29.11,57.3 28.8,57 28.19,57 27.13,58.06 27.13,61.72 30.94,65.53 v32.77,65.53
N$1
  Top 0.152: BOARD_CONNECTOR.15 10.52,55.47 8.69,53.65 8.69,41.76 11.12,39.32 25.76,39.32 40.23,53.8 44.2,53.8 OUTPUT_0-7.11 44.35,53.95 44.65,54.25 88.54,54.25 92.81,58.52 92.81,74.37 91.14,76.05 REGISTER_0-7.18
N$2
  Top 0.152: BOARD_CONNECTOR.13 10.52,53.49 8.99,51.97 8.99,41.91 11.28,39.62 25.6,39.62 42.22,56.24 44.2,56.24 OUTPUT_0-7.12 44.35,56.39 44.81,56.84 66.75,56.84 71.93,62.03 83.67,62.03 85.04,63.4 85.04,67.06 90.98,73 90.98,73.46 REGISTER_0-7.17
N$3  (via drill 0.35)
  Top 0.152: v18.29,47.7 28.8,47.7 36.58,55.47 v38.25,55.47
  Bottom 0.152: REGISTER_0-7.14 90.98,65.84 89.92,64.77 83.21,64.77 82.91,64.47 80.01,64.47 79.86,64.62 69.34,64.62 67.06,62.33 43.89,62.33 43.28,61.72 43.28,61.11 44.2,60.2 44.2,58.98 OUTPUT_0-7.13 44.2,58.83 42.67,57.3 40.08,57.3 v38.25,55.47 | v18.29,47.7 18.29,49.84 13.56,54.56 12.8,54.56 12.19,53.95 12.19,53.8 10.67,52.27 10.67,51.66 BOARD_CONNECTOR.11
N$4  (via drill 0.35)
  Top 0.152: OUTPUT_0-7.14 44.2,61.42 44.2,61.11 40.08,57 40.08,55.47 26.21,41.6 14.63,41.6 12.95,39.93 11.58,39.93 11.28,40.23 11.28,40.84 11.58,41.15 11.58,42.06 11.12,42.52 10.36,42.52 9.6,43.28 9.6,48.62 10.52,49.53 BOARD_CONNECTOR.9 | v49.53,56.24 86.72,56.24 89.92,59.44 91.14,59.44 92.2,60.5 92.2,61.27 91.14,62.33 91.14,63.4 REGISTER_0-7.13
  Bottom 0.152: v49.53,56.24 44.35,61.42 OUTPUT_0-7.14
N$6
  Top 0.152: OUTPUT_0-7.15 44.35,64.01 65.68,64.01 66.45,64.77 67.06,64.77 70.1,67.82 70.1,71.02 73.76,74.68 74.68,74.68 75.44,73.91 75.44,70.71 74.37,69.65 73.76,69.65 73.15,69.04 73.15,67.97 74.07,67.06 79.25,67.06 82.75,63.55 83.36,63.55 REGISTER_0-7.8
  Bottom 0.152: BOARD_CONNECTOR.7 10.52,47.55 10.52,46.79 9.6,45.87 9.6,43.28 10.36,42.52 11.12,42.52 12.19,41.45 12.19,41.15 17.83,35.51 48.31,35.51 51.05,38.25 53.8,38.25 65.53,49.99 65.53,58.83 66.14,59.44 79.4,59.44 83.36,63.4 REGISTER_0-7.8
N$7  (via drill 0.35)
  Top 0.152: OUTPUT_0-7.16 44.35,66.6 55.32,66.6 63.7,74.98 74.83,74.98 76.2,73.61 76.2,71.02 81.23,65.99 83.36,65.99 REGISTER_0-7.7 | v80.31,65.08 v79.25,64.01
  Bottom 0.152: v79.25,64.01 74.98,59.74 65.99,59.74 65.23,58.98 65.23,50.14 53.65,38.56 50.9,38.56 48.16,35.81 20.73,35.81 14.02,42.52 12.8,42.52 12.19,43.13 12.19,43.43 10.67,44.96 BOARD_CONNECTOR.5 | v80.31,65.08 82.6,65.08 83.36,65.84 REGISTER_0-7.7
N$8  (via drill 0.35)
  Top 0.152: v78.79,72.24 82.14,72.24 83.36,73.46 REGISTER_0-7.4 | v30.94,62.79 29.41,61.27 29.41,56.54 30.48,55.47 31.24,55.47 31.85,56.08 31.85,56.69 30.02,58.52 30.02,59.28 30.63,59.89 31.24,59.89 32.46,58.67 32.46,54.1 26.67,48.31 17.98,48.31 17.68,48.01 17.68,46.79 13.41,42.52 12.8,42.52 11.89,43.43 10.67,43.43 BOARD_CONNECTOR.3 | v33.68,65.84 35.66,65.84 35.97,65.53 36.58,65.53 40.08,69.04 44.2,69.04 OUTPUT_0-7.17
  Bottom 0.152: v78.79,72.24 73.91,72.24 71.63,69.95 65.99,69.95 65.23,69.19 44.35,69.19 OUTPUT_0-7.17 | v30.94,62.79 33.68,65.53 v33.68,65.84
N$9  (via drill 0.35)
  Top 0.152: OUTPUT_0-7.18 44.35,71.63 47.7,71.63 51.36,75.29 51.36,81.99 57,87.63 57,88.24 57.61,88.85 77.88,88.85 84.89,81.84 84.89,77.57 83.52,76.2 REGISTER_0-7.3 | v20.88,64.47 14.94,58.52 12.8,58.52 11.58,57.3 11.58,53.19 10.97,52.58 10.36,52.58 9.3,51.51 9.3,43.13 10.52,41.91 10.52,41.6 BOARD_CONNECTOR.1
  Bottom 0.152: v20.88,64.47 22.25,64.47 25.91,68.12 33.98,68.12 36.58,70.71 43.43,70.71 44.2,71.48 OUTPUT_0-7.18
N$10
  Top 0.152: LED0.A 96.01,19.36 96.01,29.11 R0.1
N$11
  Top 0.152: LED1.A 90.98,19.36 90.98,29.11 R1.1
N$12
  Top 0.152: LED2.A 85.95,19.36 85.95,29.11 R2.1
N$13
  Top 0.152: LED3.A 81.08,19.36 81.08,29.11 R3.1
N$14
  Top 0.152: LED4.A 76.05,19.36 76.05,29.11 R4.1
N$15
  Top 0.152: LED5.A 71.02,19.36 71.02,29.11 R5.1
N$16
  Top 0.152: LED6.A 65.99,19.36 65.99,29.11 R6.1
N$17
  Top 0.152: LED7.A 60.96,19.36 60.96,29.11 R7.1
N$18
  Top 0.152: OUTPUT_8-15.19 30.94,74.22 33.38,76.66 36.27,76.66 OUTPUT_0-7.1 36.42,76.66 38.86,74.22 44.2,74.22 OUTPUT_0-7.19 | BOARD_CONNECTOR.18 13.26,57.61 14.94,57.61 21.49,64.16 21.49,75.29 22.86,76.66 OUTPUT_8-15.1
  Bottom 0.152: OUTPUT_8-15.1 23.01,76.66 28.35,76.66 30.79,74.22 OUTPUT_8-15.19
N$20
  Bottom 0.152: CLOCK_GATE.3 7.77,85.8 14.48,85.8 17.83,89.15 75.74,89.15 81.69,83.21 92.51,83.21 96.77,78.94 96.77,64.01 91.14,58.37 REGISTER_0-7.11 90.98,58.37 89.61,59.74 80.92,59.74 79.55,58.37 74.37,58.37 REGISTER_8-15.11
N$21
  Top 0.152: LED8.A 56.08,19.36 56.08,29.11 R8.1
N$22
  Top 0.152: CLOCK_GATE.1 7.77,90.68 7.77,89.46 11.58,85.65 11.58,58.52 10.67,57.61 BOARD_CONNECTOR.17
N$23
  Top 0.152: CLOCK_GATE.2 7.77,88.24 7.77,86.87 9.6,85.04 9.6,62.64 10.52,61.72 BOARD_CONNECTOR.21
N$24
  Top 0.152: LED9.A 51.05,19.36 51.05,29.11 R9.1
N$25
  Top 0.152: LED10.A 46.02,19.36 46.02,29.11 R10.1
N$26
  Top 0.152: LED11.A 41,19.36 41,29.11 R11.1
N$27
  Top 0.152: LED12.A 35.97,19.36 35.97,29.11 R12.1
N$28
  Top 0.152: LED13.A 31.09,19.36 31.09,29.11 R13.1
N$29
  Top 0.152: LED14.A 26.06,19.36 26.06,29.11 R14.1
N$30
  Top 0.152: LED15.A 21.03,19.36 21.03,29.11 R15.1
VCC
  Top 0.152: C4.2 14.33,13.11 14.33,17.98 C3.2 14.33,18.14 14.33,22.86 C2.2 14.33,23.01 14.33,27.89 C1.2 14.17,28.04 8.38,33.83 8.38,56.69 10.52,58.83 10.52,59.44 BOARD_CONNECTOR.19 10.52,59.59 10.52,60.35 6.71,64.16 6.71,91.44 7.01,91.75 14.63,91.75 15.54,90.83 CLOCK_GATE.14 15.7,90.68 17.98,90.68 30.79,77.88 30.79,76.81 OUTPUT_8-15.20
  Bottom 0.152: REGISTER_0-7.20 90.98,81.08 89.92,80.01 82.6,80.01 81.53,81.08 74.37,81.08 REGISTER_8-15.20 74.22,81.08 70.56,81.08 66.75,77.27 44.81,77.27 44.35,76.81 OUTPUT_0-7.20 44.2,76.81 37.8,76.81 37.03,77.57 31.7,77.57 30.94,76.81 OUTPUT_8-15.20

### Text on the board
bNames: MARIE PC / MBR / Architecture design by: Dr. Linda Null / Hardware Implementation by: Richard Bowser